# EAGLE schematic SuperPNP (EAGLE 7.6.0)
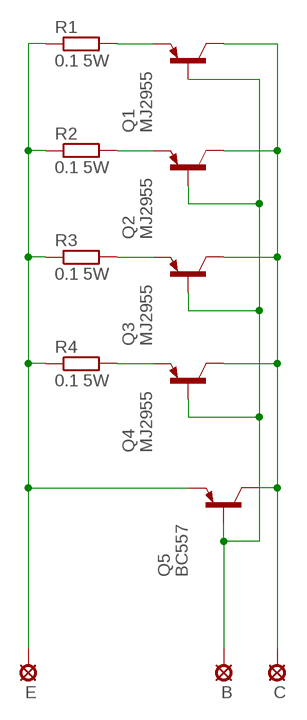
[diagram p0: schematic, sheet 1]

## Parts
B  SE14  [SE14]
C  SE14  [SE14]
E  SE14  [SE14]
Q1  MJ2955  [TO3]
Q2  MJ2955  [TO3]
Q3  MJ2955  [TO3]
Q4  MJ2955  [TO3]
Q5  BC557  [TO92]
R1  0.1 5W  R-EU_0617/22  [0617/22]
R2  0.1 5W  R-EU_0617/22  [0617/22]
R3  0.1 5W  R-EU_0617/22  [0617/22]
R4  0.1 5W  R-EU_0617/22  [0617/22]

## Nets
N$1: C.MP Q1.C Q1.C/(C) Q2.C Q2.C/(C) Q3.C Q3.C/(C) Q4.C Q4.C/(C) Q5.3(C)
N$2: Q1.E R1.2
N$3: Q2.E R2.2
N$4: Q3.E R3.2
N$5: Q4.E R4.2
N$6: E.MP Q5.1(E) R1.1 R2.1 R3.1 R4.1
N$7: B.MP Q1.B Q2.B Q3.B Q4.B Q5.2(B)

## Library data of the parts
B C E = solpad:SE14: SOLDER PAD E1553, drill 1,4mm, distributor Buerklin, 07F820
Q1-Q4 = transistor-pnp:MJ2955: PNP Transistor
Q5 = transistor-pnp:BC557: PNP Transistor
R1-R4 = rcl:R-EU_: RESISTOR, European symbol